# Altium schematic sheet TopLevel.SchDoc
size B; SheetNumber: 1; SheetTotal: 6
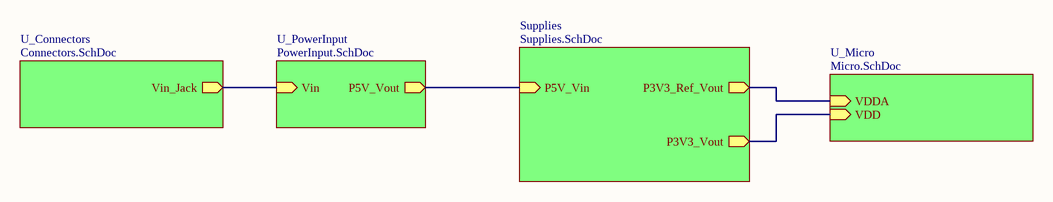
[diagram p0: TopLevel.SchDoc]

## Sub-sheets
Supplies = Supplies.SchDoc: P3V3_Ref_Vout (out), P3V3_Vout (out), P5V_Vin (in)
U_Connectors = Connectors.SchDoc: Vin_Jack (out)
U_Micro = Micro.SchDoc: VDDA (in), VDD (in)
U_PowerInput = PowerInput.SchDoc: P5V_Vout (out), Vin (in)

## Nets
(unnamed): sheet Supplies/P3V3_Ref_Vout, sheet U_Micro/VDDA
(unnamed): sheet Supplies/P3V3_Vout, sheet U_Micro/VDD
(unnamed): sheet Supplies/P5V_Vin, sheet U_PowerInput/P5V_Vout
(unnamed): sheet U_Connectors/Vin_Jack, sheet U_PowerInput/Vin